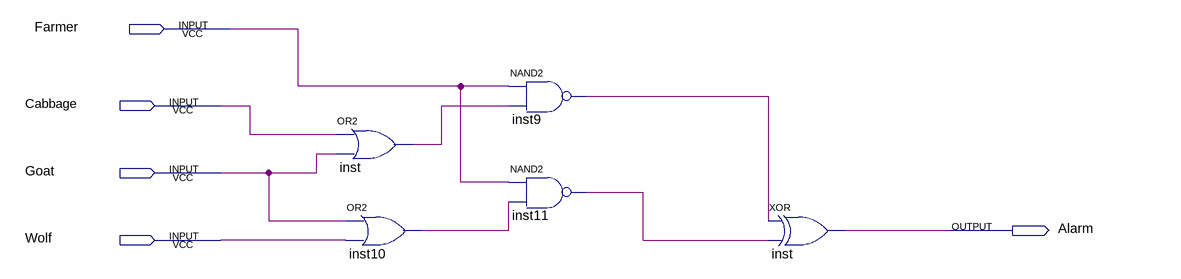
[diagram p0: schematic sheet]
// Quartus schematic lab3step0.bdf as structural Verilog: 5 symbols, 5 pins
module lab3step0 (
  input  Farmer,
  input  Cabbage,
  input  Goat,
  input  Wolf,
  output Alarm
);

  wire inst9_out, inst10_out, inst11_out, inst_out;

  or inst (inst_out, Cabbage, Goat);
  or inst10 (inst10_out, Goat, Wolf);
  nand inst9 (inst9_out, Farmer, inst_out);
  nand inst11 (inst11_out, Farmer, inst10_out);
  xor inst_dup2 (Alarm, inst9_out, inst11_out);
endmodule
